# EAGLE schematic kolektorius_v2 (EAGLE 6.3)
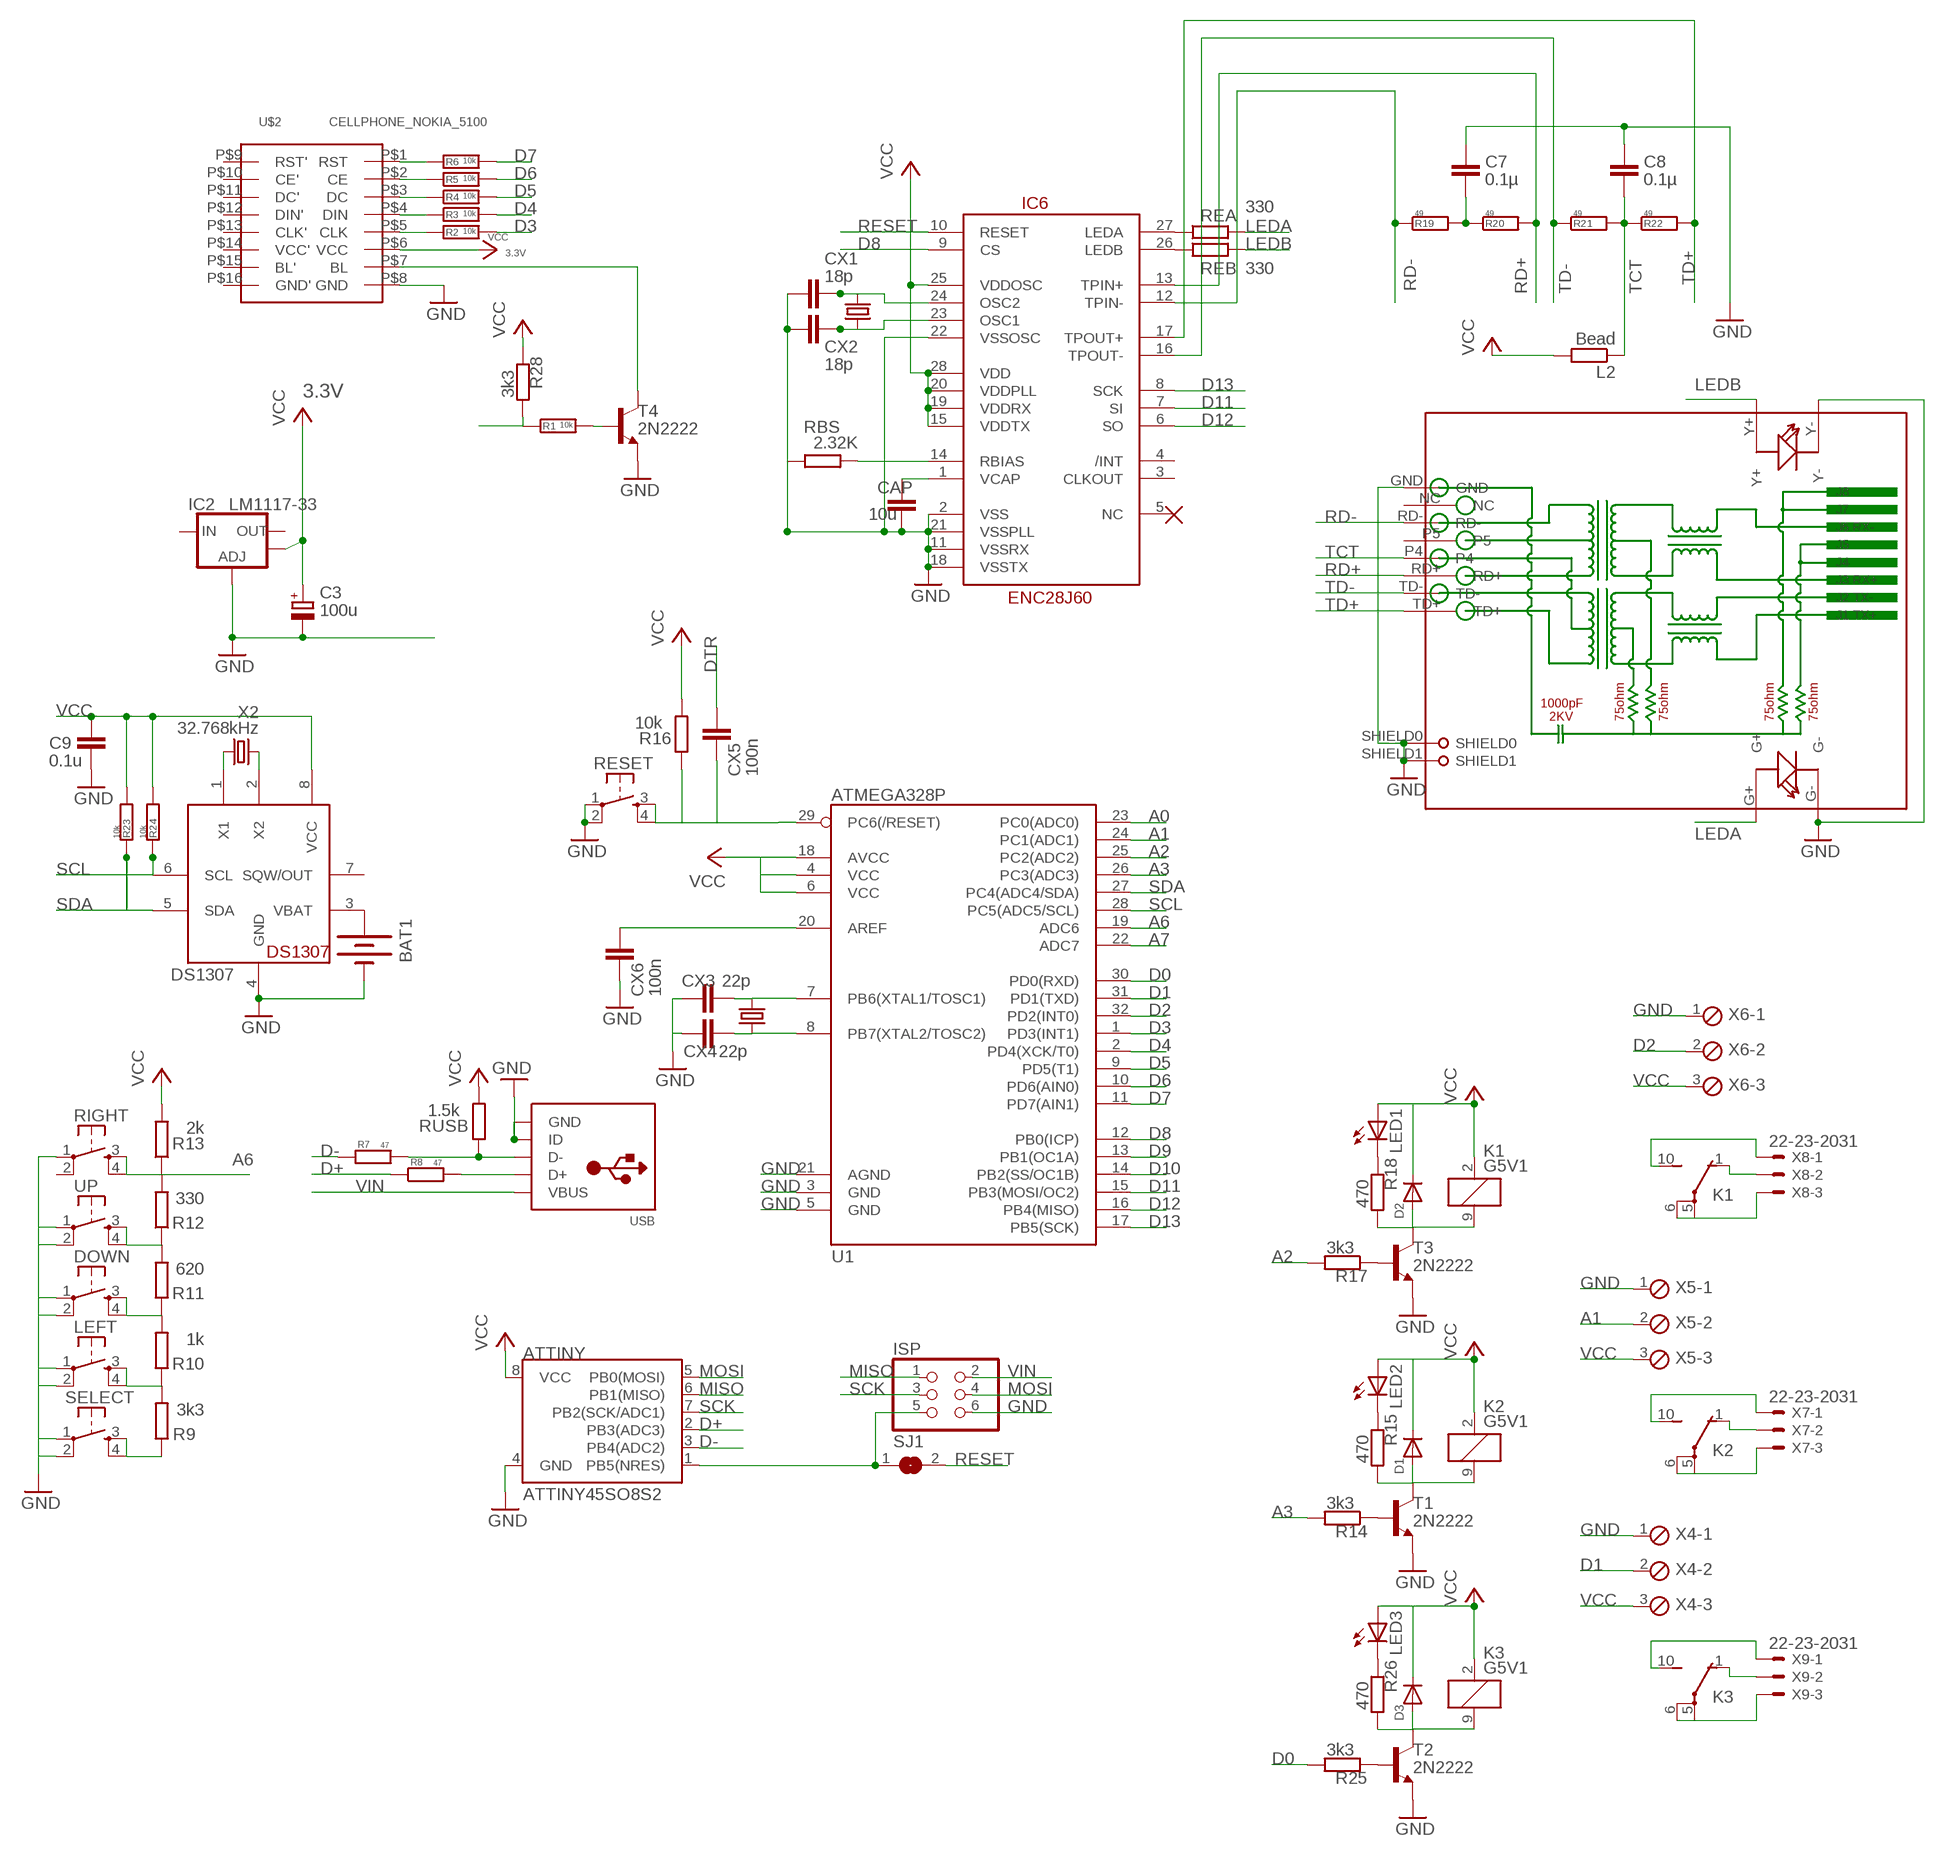
[diagram p0: schematic, sheet 1]

## Parts
ATTINY  ATTINY45SO8S2  [SO8S2]
BAT1  BATTERYBATTERY_12MM_SMT  [BATTCON_12MM_SMT]
C3  100u  CPOL-EUD  [PANASONIC_D]
C7  0.1µ  C-EUC0805  [C0805]
C8  0.1µ  C-EUC0805  [C0805]
C9  0.1u  C-EUC0805  [C0805]
CAP  10u  C-EUC0805  [C0805]
CX1  18p  C-EUC0805  [C0805]
CX2  18p  C-EUC0805  [C0805]
CX3  22p  C-EUC0805  [C0805]
CX4  22p  C-EUC0805  [C0805]
CX5  100n  C-EUC0805  [C0805]
CX6  100n  C-EUC0805  [C0805]
D1  DIODEDO-1N4148  [DO-1N4148]
D2  DIODEDO-1N4148  [DO-1N4148]
D3  DIODEDO-1N4148  [DO-1N4148]
DOWN  TAC_SWITCHPTH  [TACTILE-PTH]
DS1307  DS1307  DS1307SOIC  [SO08]
IC2  LM1117-33  V_REG_LM1117SOT223  [SOT223]
IC6  ENC28J60  [SSOP28DB]
ISP  PINHD-2X3  [2X03]
K1  G5V1  [G5V1]
K2  G5V1  [G5V1]
K3  G5V1  [G5V1]
L2  Bead  R-EU_R0805  [R0805]
LED1  LEDSMT1206  [1206]
LED2  LEDSMT1206  [1206]
LED3  LEDSMT1206  [1206]
LEFT  TAC_SWITCHPTH  [TACTILE-PTH]
R1  10k  R-EU_R0805  [R0805]
R2  10k  R-EU_R0805  [R0805]
R3  10k  R-EU_R0805  [R0805]
R4  10k  R-EU_R0805  [R0805]
R5  10k  R-EU_R0805  [R0805]
R6  10k  R-EU_R0805  [R0805]
R7  47  R-EU_R0805  [R0805]
R8  47  R-EU_R0805  [R0805]
R9  3k3  R-EU_R0805  [R0805]
R10  1k  R-EU_R0805  [R0805]
R11  620  R-EU_R0805  [R0805]
R12  330  R-EU_R0805  [R0805]
R13  2k  R-EU_R0805  [R0805]
R14  3k3  R-EU_R0805  [R0805]
R15  470  R-EU_R0805  [R0805]
R16  10k  R-EU_R0805  [R0805]
R17  3k3  R-EU_R0805  [R0805]
R18  470  R-EU_R0805  [R0805]
R19  49  R-EU_R0805  [R0805]
R20  49  R-EU_R0805  [R0805]
R21  49  R-EU_R0805  [R0805]
R22  49  R-EU_R0805  [R0805]
R23  10k  R-EU_R0805  [R0805]
R24  10k  R-EU_R0805  [R0805]
R25  3k3  R-EU_R0805  [R0805]
R26  470  R-EU_R0805  [R0805]
R28  3k3  R-EU_R0805  [R0805]
RBS  2.32K  R-EU_R0805  [R0805]
REA  330  R-EU_R0805  [R0805]
REB  330  R-EU_R0805  [R0805]
RESET  TAC_SWITCHPTH  [TACTILE-PTH]
RIGHT  TAC_SWITCHPTH  [TACTILE-PTH]
RJ45  HR911105A  [HR911105A]
RUSB  1.5k  R-EU_R0805  [R0805]
SELECT  TAC_SWITCHPTH  [TACTILE-PTH]
SJ1  SJ  [SJ]
T1  2N2222  [TO92-EBC-OVAL]
T2  2N2222  [TO92-EBC-OVAL]
T3  2N2222  [TO92-EBC-OVAL]
T4  2N2222  [TO92-EBC-OVAL]
U1  ATMEGA328P  ATMEGA328_SMT  [TQFP32-08]
U$2  CELLPHONE_NOKIA_5100  [CELLPHONE_NOKIA_5100_SPARKFUN]
UP  TAC_SWITCHPTH  [TACTILE-PTH]
USB  USBMOLEX  [USB-MINIB-THM-MOLEX]
X1  25MHz  CRYSTALHC49US  [HC49US]
X2  32.768kHz  CRYSTALTC26H  [TC26H]
X3  25MHz  CRYSTALHC49US  [HC49US]
X4  MPT3  [3POL254]
X5  MPT3  [3POL254]
X6  MPT3  [3POL254]
X7  22-23-2031  [22-23-2031]
X8  22-23-2031  [22-23-2031]
X9  22-23-2031  [22-23-2031]

## Nets
A0: U1.23(PC0(ADC0))
A1: U1.24(PC1(ADC1)) X5.2
A2: R17.2 U1.25(PC2(ADC2))
A3: R14.2 U1.26(PC3(ADC3))
A6: R12.2 R13.1 RIGHT.3 RIGHT.4 U1.19(ADC6)
A7: U1.22(ADC7)
D0: R25.2 U1.30(PD0(RXD))
D1: U1.31(PD1(TXD)) X4.2
D2: U1.32(PD2(INT0)) X6.2
D3: R2.2 U1.1(PD3(INT1))
D4: R3.2 U1.2(PD4(XCK/T0))
D5: R4.2 U1.9(PD5(T1))
D6: R5.2 U1.10(PD6(AIN0))
D7: R6.2 U1.11(PD7(AIN1))
D8: IC6.9(CS) U1.12(PB0(ICP))
D9: U1.13(PB1(OC1A))
D10: R1.1 R28.2 U1.14(PB2(SS/OC1B))
D11: IC6.7(SI) U1.15(PB3(MOSI/OC2))
D12: IC6.6(SO) U1.16(PB4(MISO))
D13: IC6.8(SCK) U1.17(PB5(SCK))
D+: ATTINY.2(PB3(ADC3)) R8.1
D-: ATTINY.3(PB4(ADC2)) R7.1
DTR: CX5.1
GND: ATTINY.4(GND) BAT1.P$1(-) C3.- C7.1 C8.1 C9.2 CAP.2 CX1.2 CX2.2 CX3.1 CX4.1 CX6.2 DOWN.1 DOWN.2 DS1307.4(GND) IC2.1(ADJ) IC6.2(VSS) IC6.11(VSSRX) IC6.18(VSSTX) IC6.21(VSSPLL) IC6.22(VSSOSC) ISP.6 LEFT.1 LEFT.2 RBS.1 RESET.1 RESET.2 RIGHT.1 RJ45.G- RJ45.GND RJ45.SHIELD0 RJ45.SHIELD1 RJ45.Y- SELECT.1 SELECT.2 T1.E T2.E T3.E T4.E U1.3(GND) U1.5(GND) U1.21(AGND) U$2.P$8(GND) UP.1 UP.2 USB.GND USB.ID X4.1 X5.1 X6.1
LEDA: REA.2 RJ45.G+
LEDB: REB.2 RJ45.Y+
MISO: ATTINY.6(PB1(MISO)) ISP.1
MOSI: ATTINY.5(PB0(MOSI)) ISP.4
N$1: LEFT.3 LEFT.4 R9.2 R10.1
N$2: D1.A K2.9 R15.2 T1.C
N$3: R14.1 T1.B
N$4 [power]: K2.5(2:P) K2.6(2:P) X7.3
N$5 [power]: K2.1(2:O) X7.2
N$6: DOWN.3 DOWN.4 R10.2 R11.1
N$7: LED2.C R15.1
N$8: DS1307.1(X1) X2.2
N$9: R11.2 R12.1 UP.3 UP.4
N$11: D3.A K3.9 R26.2 T2.C
N$12: D2.A K1.9 R18.2 T3.C
N$13: R17.1 T3.B
N$14 [power]: K2.10(2:S) X7.1
N$15 [power]: K3.10(2:S) X9.1
N$16 [power]: K1.10(2:S) X8.1
N$17: R25.1 T2.B
N$18: R9.1 SELECT.3 SELECT.4
N$19 [power]: K1.5(2:P) K1.6(2:P) X8.3
N$20 [power]: K1.1(2:O) X8.2
N$21: LED1.C R18.1
N$22: R2.1 U$2.P$5(CLK)
N$23: R5.1 U$2.P$2(CE)
N$24: R4.1 U$2.P$3(DC)
N$25: R3.1 U$2.P$4(DIN)
N$26: T4.C U$2.P$7(BL)
N$28 [power]: K3.5(2:P) K3.6(2:P) X9.3
N$29 [power]: K3.1(2:O) X9.2
N$30: DS1307.2(X2) X2.1
N$31: LED3.C R26.1
N$32: CX4.2 U1.8(PB7(XTAL2/TOSC2)) X3.1
N$33: CX3.2 U1.7(PB6(XTAL1/TOSC1)) X3.2
N$34: IC6.27(LEDA) REA.1
N$35: CX6.1 U1.20(AREF)
N$36: BAT1.P$2(+) DS1307.3(VBAT)
N$37: IC6.26(LEDB) REB.1
N$38: R8.2 USB.D+
N$39: CAP.1 IC6.1(VCAP)
N$41: CX1.1 IC6.24(OSC2) X1.2
N$42: CX2.1 IC6.23(OSC1) X1.1
N$44: R1.2 T4.B
N$45: R7.2 RUSB.1 USB.D-
N$46: CX5.2 R16.1 RESET.3 RESET.4 U1.29(PC6(/RESET))
N$52: ATTINY.1(PB5(NRES)) ISP.5 SJ1.1
N$54: C7.2 R19.2 R20.1
N$59: IC6.14(RBIAS) RBS.2
RD+: IC6.13(TPIN+) R20.2 RJ45.RD+
RD-: IC6.12(TPIN-) R19.1 RJ45.RD-
RESET: IC6.10(RESET) SJ1.2
SCK: ATTINY.7(PB2(SCK/ADC1)) ISP.3
SCL: DS1307.6(SCL) R24.1 U1.28(PC5(ADC5/SCL))
SDA: DS1307.5(SDA) R23.1 U1.27(PC4(ADC4/SDA))
TCT: C8.2 L2.1 R21.2 R22.1 RJ45.P4
TD+: IC6.17(TPOUT+) R22.2 RJ45.TD+
TD-: IC6.16(TPOUT-) R21.1 RJ45.TD-
V$: R6.1 U$2.P$1(RST)
VCC: ATTINY.8(VCC) C3.+ C9.1 D1.C D2.C D3.C DS1307.8(VCC) IC2.4(OUT) IC6.15(VDDTX) IC6.19(VDDRX) IC6.20(VDDPLL) IC6.25(VDDOSC) IC6.28(VDD) K1.2 K2.2 K3.2 L2.2 LED1.A LED2.A LED3.A R13.2 R16.2 R23.2 R24.2 R28.1 RUSB.2 U1.4(VCC) U1.6(VCC) U1.18(AVCC) U$2.P$6(VCC) X4.3 X5.3 X6.3
VIN: ISP.2 USB.VBUS
Unconnected: DS1307.7(SQW/OUT) IC2.2(OUT) IC2.3(IN) IC6.3(CLKOUT) IC6.4(/INT) IC6.5(NC) RIGHT.2 RJ45.NC RJ45.P5 U$2.P$9(RST') U$2.P$10(CE') U$2.P$11(DC') U$2.P$12(DIN') U$2.P$13(CLK') U$2.P$14(VCC') U$2.P$15(BL') U$2.P$16(GND')

## Notes on the sheet
- 3.3V
- 3.3V

## Library data of the parts
ATTINY = SparkFun:ATTINY45: Atmel ATTiny45
BAT1 = SparkFunNew:BATTERY: Battery Holders Various common sizes : AA, AAA, 20mm coin cell and 12mm coin cell.
C3 = resistor:CPOL-EU: POLARIZED CAPACITOR, European symbol
C7 C8 CAP CX1-CX6 = resistor:C-EU: CAPACITOR, European symbol
C9 = rcl:C-EU: CAPACITOR, European symbol
D1-D3 = adafruit:DIODE: Diode SMADIODE - SMA Surface Mount Package 20V 1A Schottky Diode Digikey: 641-1014-6-ND DO-1N4148 - Through Hole Small Current Diode SOD-123 20V 1 A (.5mV Vf) Schottky Diode - Digikey: MBRX120TPMSCT-ND SOD-323 10V 570mA (.38mV Vf, 3ns) Schottky Diode - Digikey: ZLLS410CT-ND SOD-523 30V 30mA Schottky Diode (RB751S-40TE61) - Digikey: RB751S-40TE61CT-ND SOT23-R/W - SOT23 Package (R = Solder Paste/Reflow Ovens, W = Hand-Soldering) BAT54Film 40V 300mA - Digikey: 497-7162-1-ND
DOWN LEFT RESET RIGHT SELECT UP = SparkFun-Electromechanical:TAC_SWITCH: Momentary Switch Button commonly used for reset or general input. Spark Fun Electronics SKU : COM-00097 SMT- SWCH-08247
DS1307 = adafruit:DS1307: DS1307 Real time clock (RTC) with battery backup ability. Talk to it via i2c
IC2 = SparkFun:V_REG_LM1117: Voltage Regulator LM1117 Standard adjustable voltage regulator but in SMD form. Spark Fun Electronics SKU : COM-00595
IC6 = SparkFun-DigitalIC:ENC28J60: Microchip SPI 10Base ethernet IC
ISP = pinhead:PINHD-2X3: PIN HEADER
K1-K3 = relay:G5V1: RELAY 1 x switch, 0.5 A/125 V AC, 1 A/24 V DC , Omron; MPN: G5V-1-DC24; OC_FARNELL: 9949593; OC_NEWARK: 36M6377
L2 R1-R26 R28 RBS REA REB RUSB = rcl:R-EU_: RESISTOR, European symbol
LED1-LED3 = adafruit:LED: LED OSRAM: - CHIPLED LG R971, LG N971, LY N971, LG Q971, LY Q971, LO R971, LY R971 LH N974, LH R974 LS Q976, LO Q976, LY Q976 LO Q996 - Hyper CHIPLED LW Q18S LB Q993, LB Q99A, LB R99A - SideLED LS A670, LO A670, LY A670, LG A670, LP A670 LB A673, LV A673, LT A673, LW A673 LH A674 LY A675 LS A676, LA A676, LO A676, LY A676, LW A676 LS A679, LY A679, LG A679 - Hyper Micro SIDELED® LS Y876, LA Y876, LO Y876, LY Y876 LT Y87S - SmartLED LW L88C, LW L88S LB L89C, LB L89S, LG L890 LS L89K, LO L89K, LY L89K LS L896, LA L896, LO L896, LY L896 - TOPLED LS T670, LO T670, LY T670, LG T670, LP T670 LSG T670, LSP T670, LSY T670, LOP T670, LYG T670 LG T671, LOG T671, LSG T671 LB T673, LV T673, LT T673, LW T673 LH T674 LS T676, LA T676, LO T676, LY T676, LB T676, LH T676, LSB T676, LW T676 LB T67C, LV T67C, LT T67C, LS T67K, LO T67K, LY T67K, LW E67C LS E67B, LA E67B, LO E67B, LY E67B, LB E67C, LV E67C, LT E67C LW T67C LS T679, LY T679, LG T679 LS T770, LO T770, LY T770, LG T770, LP T770 LB T773, LV T773, LT T773, LW T773 LH T774 LS E675, LA E675, LY E675, LS T675 LS T776, LA T776, LO T776, LY T776, LB T776 LHGB T686 LT T68C, LB T68C - Hyper Mini TOPLED® LB M676 - Mini TOPLED Santana® LG M470 LS M47K, LO M47K, LY M47K Source: http://www.osram.convergy.de/
RJ45 = CONNECTER:HR911105A
SJ1 = jumper:SJ: SMD solder JUMPER
T1-T4 = adafruit:2N2222: NPN TRANSISTOR Big oval pads
U1 = SparkFun-DigitalIC:ATMEGA328_SMT: 32-Pin Atmega328 part Commonly used on Arduino compatible boards Available in QFP and QFN packages TQFP is IC-09069 QFN is non-stock; PROD_ID: IC-09069
U$2 = DIY-Cellphone:CELLPHONE_NOKIA_5100
USB = adafruit:USB: USB Connectors USBMINIB - Surface Mount Female Mini-B USB Connector 4UConnector: 06564 By microbuilder.eu Thru-hole RA Female Mini-B USB Connector 4UConnector: 18732 By ladyada.net
X1 X3 = SparkFun:CRYSTAL: Crystals Various standard crystals. Proven footprints. Spark Fun Electronics SKU : COM-00534
X2 = crystal:CRYSTAL: CRYSTAL; OC_FARNELL: unknown; OC_NEWARK: unknown
X4-X6 = con-phoenix-254:MPT3: PHOENIX CONNECTOR; OC_FARNELL: unknown; OC_NEWARK: unknown
X7-X9 = con-molex:22-23-2031: .100" (2.54mm) Center Header - 3 Pin; MF: MOLEX; MPN: 22-23-2031; OC_FARNELL: 1462950; OC_NEWARK: 30C0862

## Net classes
0 default: width 0.305 mm, clearance 0.203 mm
1 power: width 0.61 mm, clearance 0.203 mm